# EAGLE design wooden_alarm (EAGLE 9.6.2)
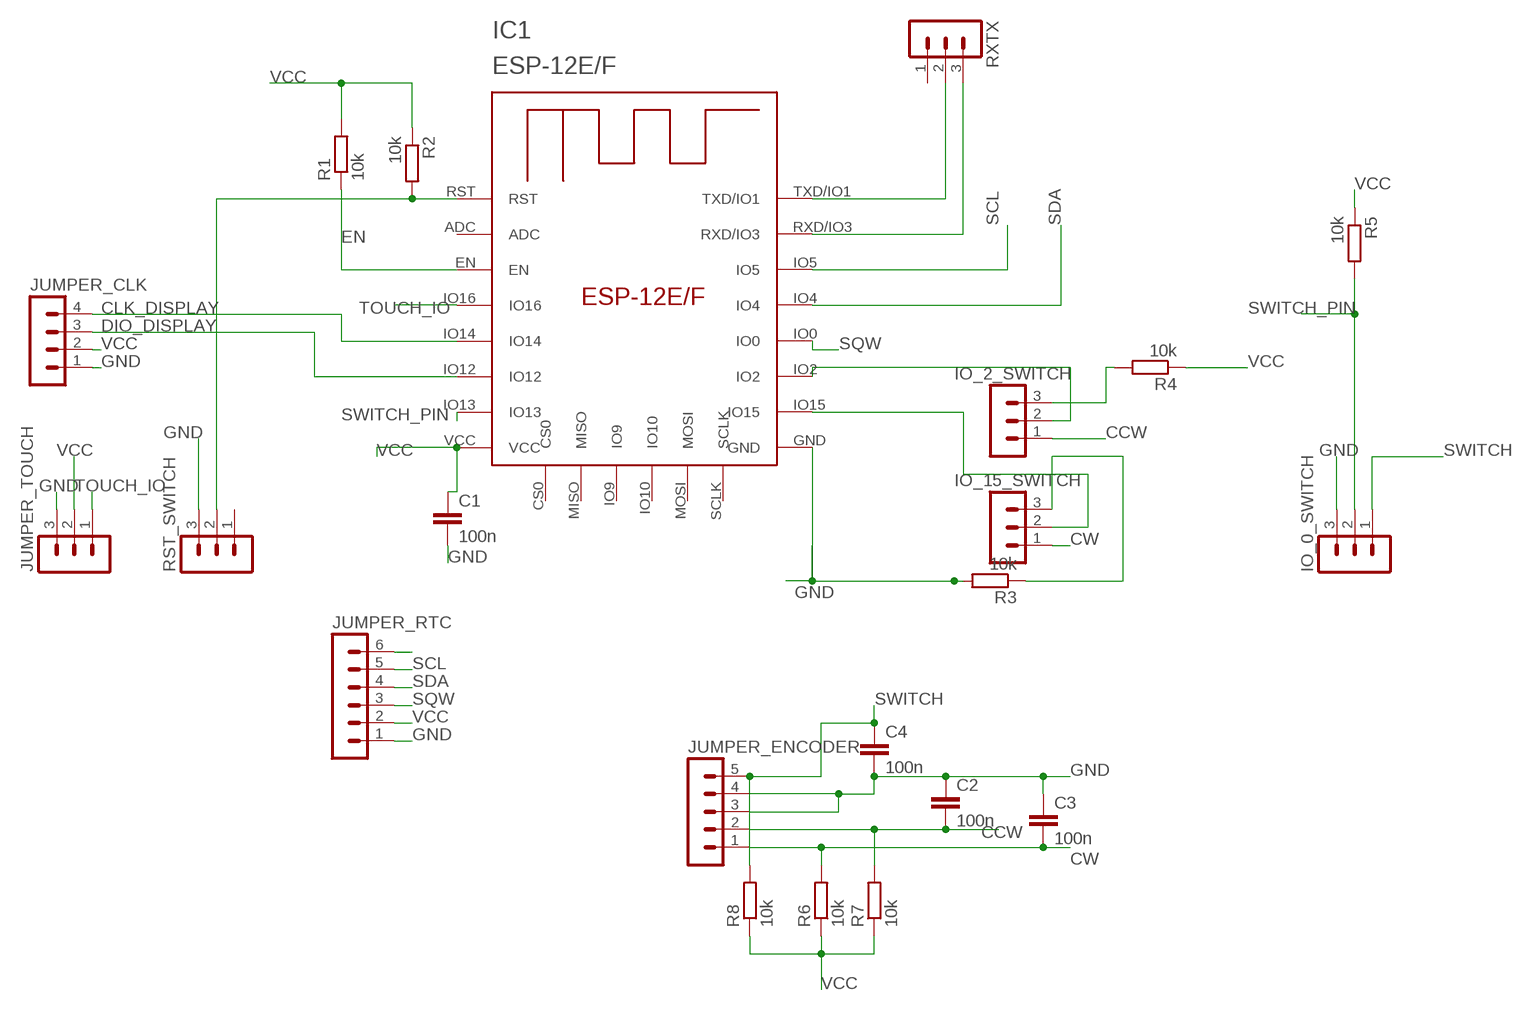
[diagram p0: schematic, sheet 1]

## Parts
C1  100n  C-EUC0805  [C0805]
C2  100n  C-EUC1206  [C1206]
C3  100n  C-EUC1206  [C1206]
C4  100n  C-EUC1206  [C1206]
IC1  ESP-12E/F  [ESP-12E]
IO_0_SWITCH  MA03-1  [MA03-1]
IO_2_SWITCH  MA03-1  [MA03-1]
IO_15_SWITCH  MA03-1  [MA03-1]
JUMPER_CLK  MA04-1  [MA04-1]
JUMPER_ENCODER  MA05-1  [MA05-1]
JUMPER_RTC  MA06-1  [MA06-1]
JUMPER_TOUCH  MA03-1  [MA03-1]
R1  10k  R-EU_R0805  [R0805]
R2  10k  R-EU_R0805  [R0805]
R3  10k  R-EU_R0805  [R0805]
R4  10k  R-EU_R0805  [R0805]
R5  10k  R-EU_R0805  [R0805]
R6  10k  R-EU_R0805  [R0805]
R7  10k  R-EU_R0805  [R0805]
R8  10k  R-EU_R0805  [R0805]
RST_SWITCH  MA03-1  [MA03-1]
RXTX  MA03-1  [MA03-1]

## Nets
CCW: C2.2 IO_2_SWITCH.1 JUMPER_ENCODER.2 R7.2
CLK_DISPLAY: IC1.IO14 JUMPER_CLK.4
CW: C3.2 IO_15_SWITCH.1 JUMPER_ENCODER.1 R6.2
DIO_DISPLAY: IC1.IO12 JUMPER_CLK.3
EN: IC1.EN R1.1
GND: C1.2 C2.1 C3.1 C4.2 IC1.GND IO_0_SWITCH.3 JUMPER_CLK.1 JUMPER_ENCODER.3 JUMPER_ENCODER.4 JUMPER_RTC.1 JUMPER_TOUCH.3 R3.2 RST_SWITCH.3
N$1: IC1.RST R2.2 RST_SWITCH.2
N$2: IO_2_SWITCH.3 R4.2
N$3: IC1.IO15 IO_15_SWITCH.2
N$5: IO_15_SWITCH.3 R3.1
N$7: IC1.IO2 IO_2_SWITCH.2
N$14: JUMPER_RTC.6
RX: IC1.RXD/IO3 RXTX.3
SCL: IC1.IO5 JUMPER_RTC.5
SDA: IC1.IO4 JUMPER_RTC.4
SQW: IC1.IO0 JUMPER_RTC.3
SWITCH: C4.1 IO_0_SWITCH.1 JUMPER_ENCODER.5 R8.2
SWITCH_PIN: IC1.IO13 IO_0_SWITCH.2 R5.2
TOUCH_IO: IC1.IO16 JUMPER_TOUCH.1
TX: IC1.TXD/IO1 RXTX.2
VCC: C1.1 IC1.VCC JUMPER_CLK.2 JUMPER_RTC.2 JUMPER_TOUCH.2 R1.2 R2.1 R4.1 R5.1 R6.1 R7.1 R8.1
Unconnected: IC1.ADC IC1.CS0 IC1.IO9 IC1.IO10 IC1.MISO IC1.MOSI IC1.SCLK RST_SWITCH.1 RXTX.1

## Library data of the parts
C1-C4 = rcl:C-EU: CAPACITOR, European symbol; SPICEPREFIX: C
IC1 = esp-12e-f:ESP-12E/F
IO_0_SWITCH IO_2_SWITCH IO_15_SWITCH JUMPER_TOUCH RST_SWITCH RXTX = con-lstb:MA03-1: PIN HEADER; OC_FARNELL: unknown; OC_NEWARK: unknown
JUMPER_CLK = con-lstb:MA04-1: PIN HEADER; OC_FARNELL: unknown; OC_NEWARK: unknown
JUMPER_ENCODER = con-lstb:MA05-1: PIN HEADER; OC_FARNELL: unknown; OC_NEWARK: unknown
JUMPER_RTC = con-lstb:MA06-1: PIN HEADER; OC_FARNELL: unknown; OC_NEWARK: unknown
R1-R8 = rcl:R-EU_: RESISTOR, European symbol; SPICEPREFIX: R

## Net classes
0 default: width 0.152 mm, drill 0.1 mm
1 other: width 0.152 mm, drill 0.1 mm, clearance 0.205 mm to class 0, clearance 0.205 mm

## Board
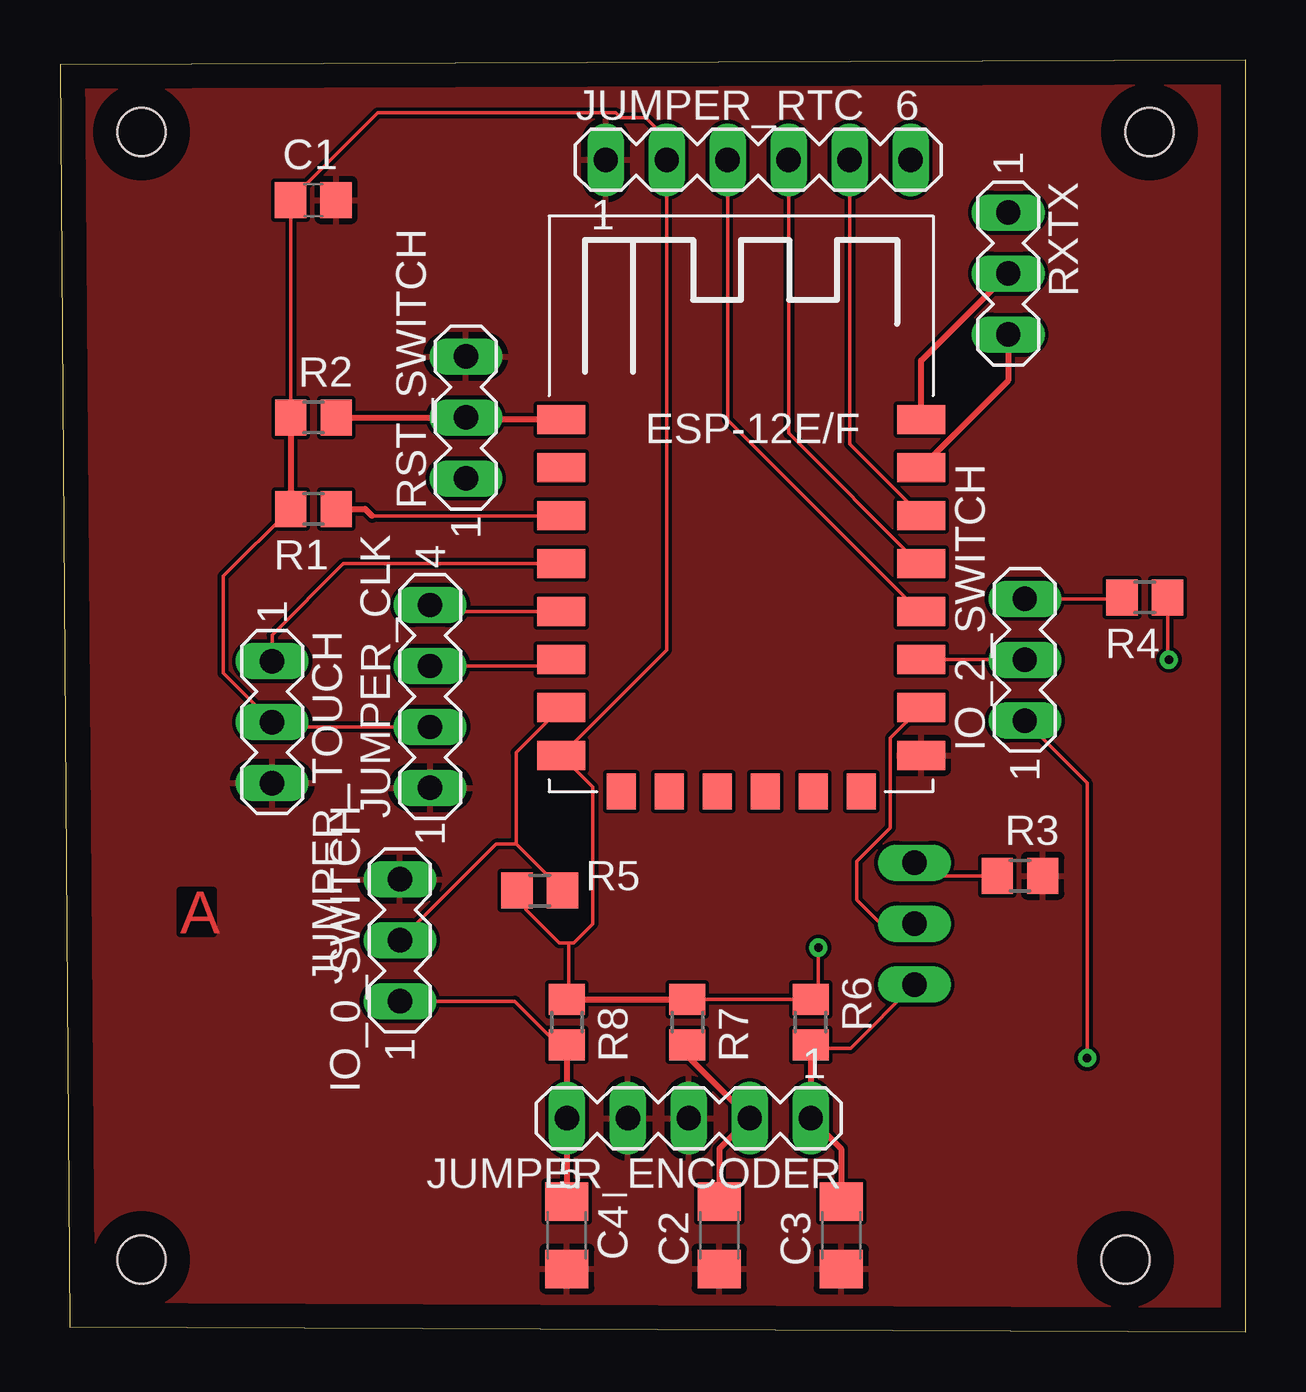
[diagram p1: board, top side]
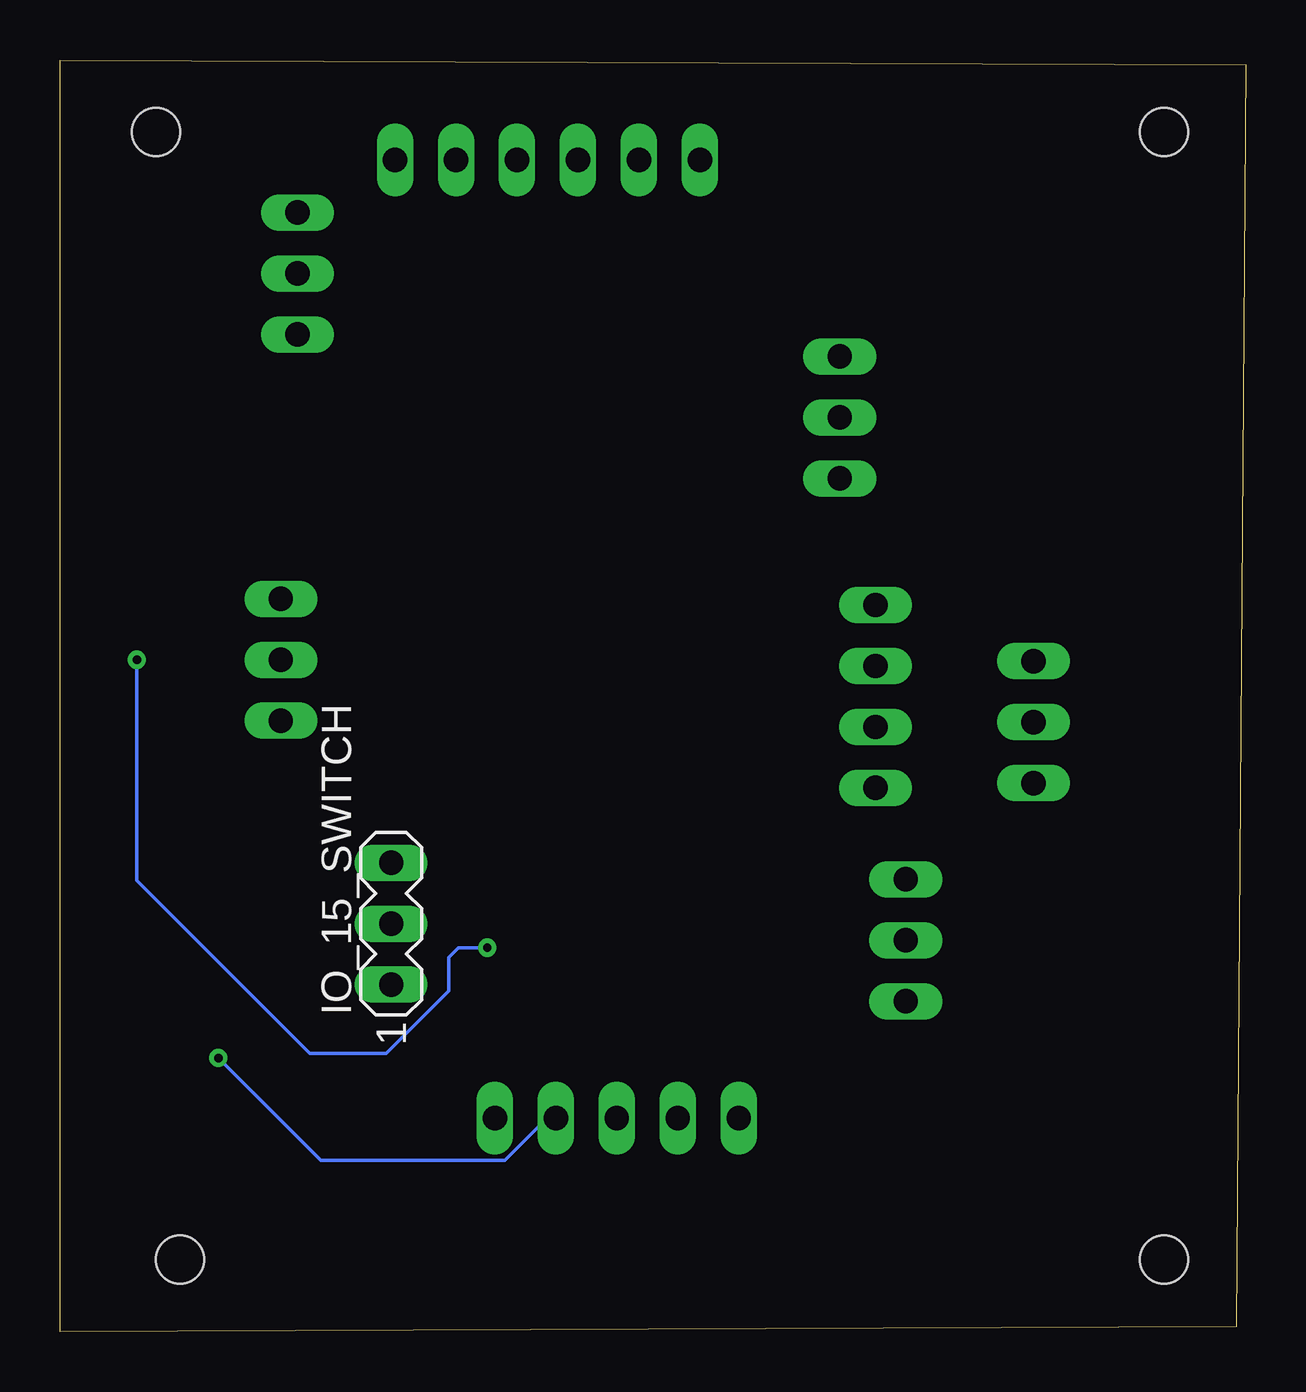
[diagram p2: board, bottom side, seen from below]

Size 49.4 x 53 mm. Coordinates in mm from the lower left corner, seen from the top.
Outline: 0.4,0.2 49.4,0 49.4,53 0,52.8 0.4,0.2
Copper layers (1*16): Top 0.035mm / dielectric 1.5mm / Bottom 0.035mm
Design rules "default": minimum track width 6mil, minimum drill 0.35mm, track to track 6mil, track to pad 6mil, pad to pad 6mil, via to via 6mil, smd to smd 6mil, copper to edge 40mil, drill to drill 6mil, minimum pad ring 10mil, minimum via ring 8mil, stop-mask expansion 4mil, vias tented up to drill 0mil, thermal gap 10mil
Holes 2 mm at 44.4,3 3.4,3 45.4,50 3.4,50

### Footprints (pad centres in the part's own frame; a part is rotated, then mirrored left to right if it is on the bottom)
C0805 = smd 1.3 x 1.5: 1 -0.95,0; 2 0.95,0
C1206 = smd 1.6 x 1.8: 1 -1.4,0; 2 1.4,0
ESP-12E = smd 2 x 1.2: ADC -7.46,5.53; EN -7.46,3.53; GND 7.54,-6.47; IO0 7.54,-0.47; IO2 7.54,-2.47; IO4 7.54,1.53; IO5 7.54,3.53; IO12 -7.46,-2.47; IO13 -7.46,-4.47; IO14 -7.46,-0.47; IO15 7.54,-4.47; IO16 -7.46,1.53; RST -7.46,7.53; RXD/IO3 7.54,5.53; TXD/IO1 7.54,7.53; VCC -7.46,-6.47 | smd 1.2 x 1.5: CS0 -4.96,-7.97; IO9 -0.96,-7.97; IO10 1.04,-7.97; MISO -2.96,-7.97; MOSI 3.04,-7.97; SCLK 5.04,-7.97
MA03-1 = drill 1.016 long: 1 -2.54,0; 2 0,0; 3 2.54,0
MA04-1 = drill 1.016 long: 1 -3.81,0; 2 -1.27,0; 3 1.27,0; 4 3.81,0
MA05-1 = drill 1.016 long: 1 -5.08,0; 2 -2.54,0; 3 0,0; 4 2.54,0; 5 5.08,0
MA06-1 = drill 1.016 long: 1 -6.35,0; 2 -3.81,0; 3 -1.27,0; 4 1.27,0; 5 3.81,0; 6 6.35,0
R0805 = smd 1.3 x 1.5: 1 -0.95,0; 2 0.95,0

### Placement (x,y rotation side)
C1  10.55,47.16 0 top
C2  27.47,4.01 90 top
C3  32.55,4.01 90 top
C4  21.12,4.01 270 top
IC1  28.34,30.48 0 top
IO_0_SWITCH  14.16,16.31 90 top
IO_2_SWITCH  40.2,28 90 top
IO_15_SWITCH  35.6,17 90 bottom
JUMPER_CLK  15.42,26.47 90 top
JUMPER_ENCODER  26.2,8.89 180 top
JUMPER_RTC  29.09,48.84 0 top
JUMPER_TOUCH  8.84,25.4 270 top
R1  10.56,34.29 180 top
R2  10.56,38.1 0 top
R3  40,19 0 top
R4  45.2,30.6 180 top
R5  19.99,18.38 0 top
R6  31.28,12.9 270 top
R7  26.14,12.9 270 top
R8  21.12,12.9 270 top
RST_SWITCH  16.91,38.1 90 top
RXTX  39.51,44.1 270 top

### Tracks (layer width: path | path; a pad name or v marks a point on that pad's centre or on a via)
CCW  (via drill 0.35)
  Top 0.152: IO_2_SWITCH.1 42.8,22.86 v42.8,11.4
  Top 0.25: R7.2 26.14,11.49 JUMPER_ENCODER.2 27.47,7.62 C2.2
  Bottom 0.152: JUMPER_ENCODER.2 29.12,8.89 30.87,7.14 38.54,7.14 v42.8,11.4
CLK_DISPLAY
  Top 0.152: JUMPER_CLK.4 15.69,30.01 IC1.IO14
CW
  Top 0.152: IO_15_SWITCH.1 32.94,11.8 31.28,11.8
  Top 0.25: R6.2 31.28,11.8 JUMPER_ENCODER.1 32.55,7.62 C3.2
DIO_DISPLAY
  Top 0.152: JUMPER_CLK.3 19.8,27.74 20.61,27.74 IC1.IO12
EN
  Top 0.152: 13,34 IC1.EN
  Top 0.25: R1.1 12.71,34.29 13,34 | IC1.EN
GND
  pour Top: 0.87,52.46 0.87,4.28 arc90 4.75,0.4 49.29,0.4 49.29,52.46
N$1
  Top 0.25: R2.2 RST_SWITCH.2 17,38.01 IC1.RST
N$2
  Top 0.152: IO_2_SWITCH.3 44.19,30.54 R4.2
N$3
  Top 0.152: IC1.IO15 34.6,24.73 34.6,21 33.2,19.6 33.2,18 34.2,17 IO_15_SWITCH.2
N$5
  Top 0.152: R3.1 36.14,19 IO_15_SWITCH.3
N$7
  Top 0.152: IC1.IO2 IO_2_SWITCH.2
RX
  Top 0.25: IC1.RXD/IO3 39.51,39.64 RXTX.3
SCL
  Top 0.152: JUMPER_RTC.5 32.9,36.99 IC1.IO5
SDA
  Top 0.152: JUMPER_RTC.4 30.36,37.44 35.79,32.01 IC1.IO4
SQW
  Top 0.152: JUMPER_RTC.3 27.82,38 35.81,30.01 IC1.IO0
SWITCH
  Top 0.152: IO_0_SWITCH.1 18.95,13.77 21.12,11.6
  Top 0.25: JUMPER_ENCODER.5 C4.1 JUMPER_ENCODER.5 | JUMPER_ENCODER.5 21.12,11.6 R8.2
SWITCH_PIN
  Top 0.152: IO_0_SWITCH.2 15.53,17.68 15.63,17.78 18.17,20.32 19,20.32 | IC1.IO13 19,24.13 19,20.32 | R5.2 19,20.32
TOUCH_IO
  Top 0.152: IC1.IO16 11.81,32.01 8.84,29.04 JUMPER_TOUCH.1
TX
  Top 0.25: RXTX.2 35.88,40.47 IC1.TXD/IO1
VCC  (via drill 0.35)
  Top 0.152: R2.1 C1.1 13.23,50.79 23.15,50.79 23.34,50.6 24.4,50.6 25.28,49.72 JUMPER_RTC.2 25.28,28.41 IC1.VCC 22.2,22.69 22.2,17 21.4,16.2 21.2,16.2 | JUMPER_CLK.2 9.04,25.2 JUMPER_TOUCH.2 6.8,27.44 6.8,31.48 R1.2 | 21.2,16.2 20.8,16.2 19.4,17.6 19.4,18.02 R5.1 | 21.2,16.2 21.2,13.93 R8.1 | R4.1 46.15,28.05 v46.2,28 | v31.6,16 31.6,14.17 R6.1 R7.1
  Top 0.25: R2.1 R1.2 | R8.1 R7.1
  Bottom 0.152: v46.2,28 46.2,18.8 39,11.6 35.8,11.6 33.2,14.2 33.2,15.6 32.8,16 v31.6,16

### Text on the board
Top: A
tStop: A
tKeepout: A